# EAGLE design BuckTest (EAGLE 5.11)
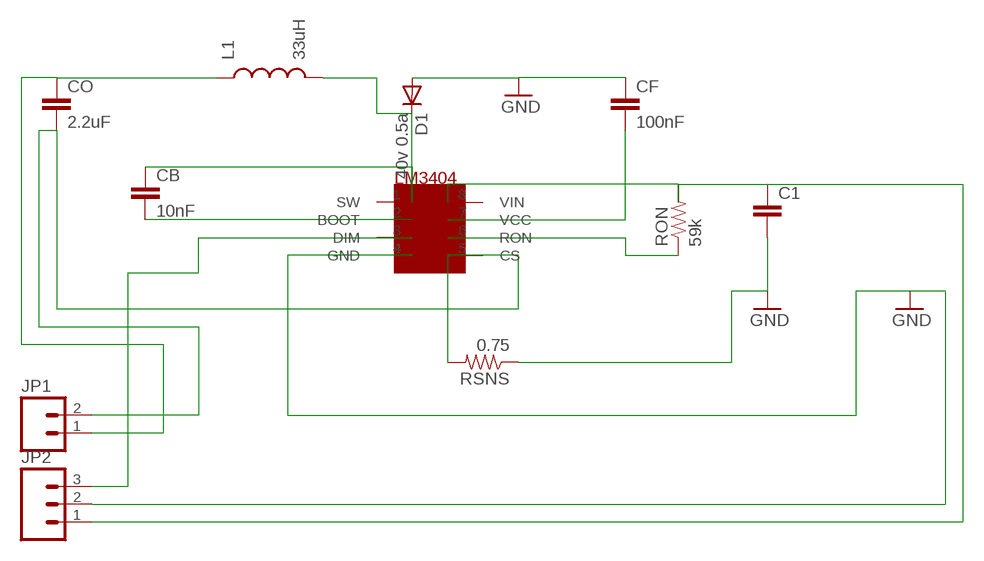
[diagram p0: schematic, sheet 1]

## Parts
C1  CAP1206  [1206]
CB  10nF  CAP0805  [0805]
CF  100nF  CAP0805  [0805]
CO  2.2uF  CAP0805  [0805]
D1  40v 0.5a  CGRM4001-G  [SOD-123_MINI-SMA]
JP1  M02LOCK  [1X02_LOCK]
JP2  M03PTH  [1X03]
L1  33uH  INDUCTORCR75  [CR75]
RON  59k  RESISTOR0603-RES  [0603-RES]
RSNS  0.75  RESISTOR0805-RES  [0805]
U$1  LM3404LM3404-SOIC8  [SOIC8]

## Nets
GND: C1.2 CF.1 D1.A JP2.2 RSNS.1 U$1.4(GND)
N$1: CB.2 U$1.2(BOOT)
N$2: RON.1 U$1.6(RON)
N$3: CB.1 D1.C L1.P$2 U$1.1(SW)
N$4: CO.1 JP1.1 L1.P$1
N$5: CO.2 JP1.2 RSNS.2 U$1.5(CS)
N$7: CF.2 U$1.7(VCC)
N$8: JP2.3 U$1.3(DIM)
VIN: C1.1 JP2.1 RON.2 U$1.8(VIN)

## Library data of the parts
C1 CB CF CO = SparkFun:CAP: Capacitor Standard 0603 ceramic capacitor, and 0.1" leaded capacitor.
D1 = diode:CGRM400*-G: Molded plasitc,JEDEC SOD-123/Mini SMA Source: Comchip CGRM4001-G.pdf
JP1 = SparkFun:M02: Header 2 Standard 2-pin 0.1" header. Use with straight break away headers (SKU : PRT-00116), right angle break away headers (PRT-00553), swiss pins (PRT-00743), machine pins (PRT-00117), and female headers (PRT-00115). Molex polarized connector foot print use with SKU : PRT-08233 with associated crimp pins and housings.
JP2 = SparkFun:M03: Header 3 Standard 3-pin 0.1" header. Use with straight break away headers (SKU : PRT-00116), right angle break away headers (PRT-00553), swiss pins (PRT-00743), machine pins (PRT-00117), and female headers (PRT-00115). Molex polarized connector foot print use with SKU : PRT-08232 with associated crimp pins and housings.
L1 = SparkFun:INDUCTOR: Inductors Basic Inductor/Choke - 0603 and 1206. Footprints are not proven and vary greatly between part numbers.
RON RSNS = SparkFun:RESISTOR: Resistor Basic schematic elements and footprints for 0603, 1206, and PTH resistors.
U$1 = SparkFun:LM3404

## Net classes
0 default: width 0.508 mm, drill 1.016 mm, clearance 0.508 mm

## Board
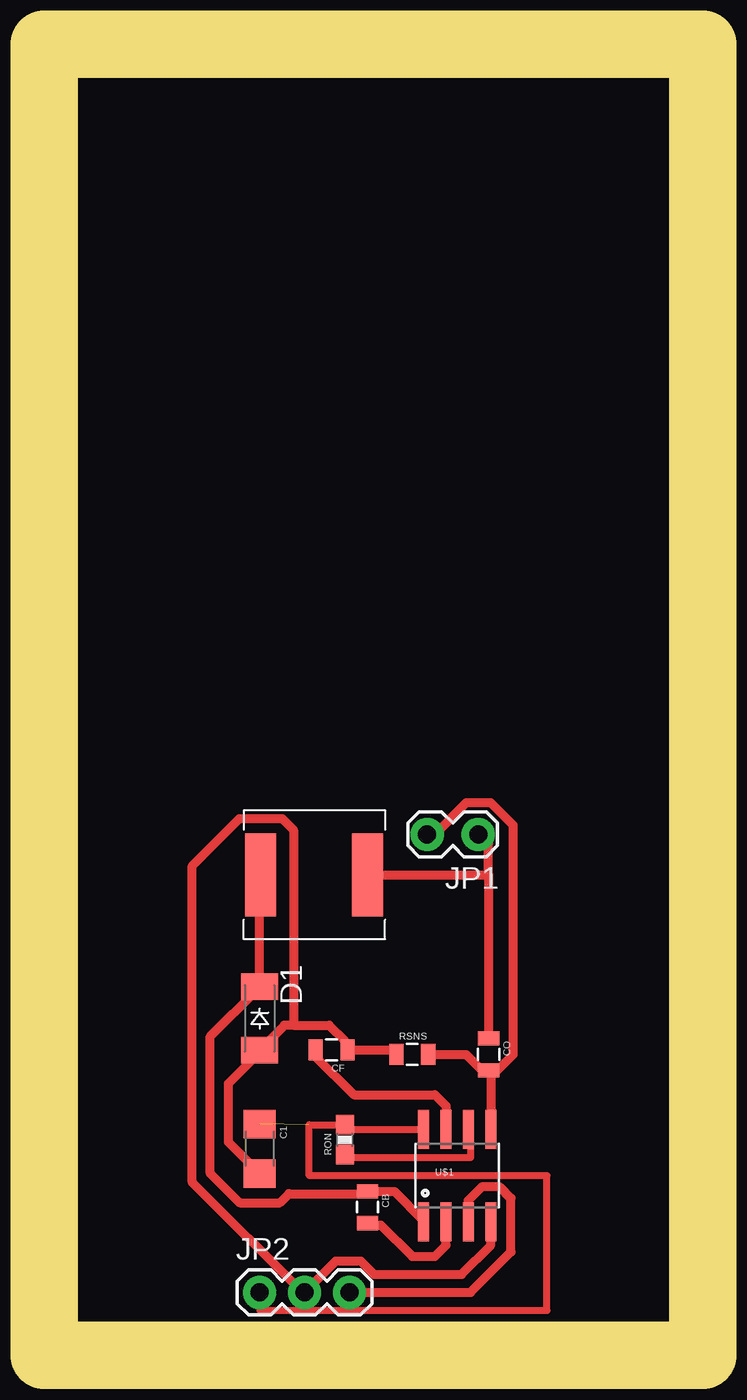
[diagram p1: board, top side]

Size 37.26 x 74.16 mm. Coordinates in mm from the lower left corner, seen from the top.
Outline: 0,0 37.26,0 37.26,74.16 0,74.16 0,0
Copper layers (1*16): Top 0.035mm / dielectric 1.5mm / Bottom 0.035mm
Design rules "default *": minimum track width 10mil, minimum drill 24mil, track to track 20mil, track to pad 20mil, pad to pad 20mil, via to via 20mil, smd to smd 20mil, copper to edge 40mil, drill to drill 8mil, minimum pad ring 10mil, minimum via ring 8mil, stop-mask expansion 4mil, vias tented up to drill 0mil, thermal gap 10mil

### Footprints (pad centres in the part's own frame; a part is rotated, then mirrored left to right if it is on the bottom)
1206 = smd 1.6 x 1.8: 1 -1.4,0; 2 1.4,0
0805 = smd 0.8 x 1.2: 1 -0.9,0; 2 0.9,0
SOD-123_MINI-SMA = smd 1.5 x 2.1: A 1.8,0; C -1.8,0
1X02_LOCK = drill 1.016 pad 1.88 round: 1 -0.178,0; 2 2.718,0
1X03 = drill 1.016 pad 1.88 round: 1 0,0; 2 2.54,0; 3 5.08,0
CR75 = smd 1.75 x 4.7: P$1 0,0; P$2 6.05,0
0603-RES = smd 1.1 x 1: 1 -0.85,0; 2 0.85,0
SOIC8 = smd 0.61 x 2.21: 1 -1.905,-2.616; 2 -0.635,-2.616; 3 0.635,-2.616; 4 1.905,-2.616; 5 1.905,2.616; 6 0.635,2.616; 7 -0.635,2.616; 8 -1.905,2.616

### Placement (x,y rotation side)
C1  12.19,11.68 270 top
CB  18.29,8.38 270 top
CF  16.26,17.27 180 top
CO  25.15,17.02 270 top
D1  12.19,19.05 270 top
JP1  24.38,29.46 180 top
JP2  12.19,3.56 0 top
L1  18.29,27.18 180 top
RON  17.02,12.19 90 top
RSNS  20.83,17.02 0 top
U$1  23.37,10.16 0 top

### Tracks (layer width: path | path; a pad name or v marks a point on that pad's centre or on a via)
GND
  Top 0.508: RSNS.1 19.81,17.02 19.56,17.27 CF.1 17.02,17.4 17.02,17.78 16.13,18.67 14.1,18.67 | C1.2 10.41,12.06 10.41,15.37 12.19,17.14 D1.A 12.32,17.4 13.59,18.67 14.1,18.67 | U$1.4 25.27,6.22 23.62,4.57 18.67,4.57 17.91,5.33 16.51,5.33 JP2.2 14.61,3.56 8.38,9.78 8.38,27.69 11.05,30.35 13.46,30.35 14.1,29.72 14.1,18.67
N$1
  Top 0.508: CB.2 18.29,7.37 19.05,7.37 20.83,5.59 22.1,5.59 22.73,6.22 U$1.2
N$2
  Top 0.406: U$1.6 24.13,12.78 24.13,11.18 17.02,11.18 RON.1
N$3
  Top 0.508: U$1.1 21.46,7.62 19.81,9.27 CB.1 18.16,9.14 13.84,9.14 13.34,8.64 11.05,8.64 9.4,10.29 9.4,18.03 12.07,20.7 D1.C 12.19,27.18 L1.P$2
N$4
  Top 0.508: 25.15,27.18 25.15,28.96 24.64,29.46 JP1.1 | 25.15,27.18 CO.1 | L1.P$1 25.15,27.18
N$5
  Top 0.508: RSNS.2 23.88,17.02 24.77,16.13 CO.2 | U$1.5 25.27,16 CO.2 | JP1.2 22.1,29.46 23.88,31.24 25.27,31.24 26.54,29.97 26.54,17.02 25.53,16 CO.2
N$7
  Top 0.508: CF.2 15.37,16.89 17.53,14.73 22.1,14.73 22.73,14.1 U$1.7
N$8
  Top 0.508: JP2.3 24.13,3.56 26.42,5.84 26.42,8.89 25.78,9.53 24.77,9.53 24,8.76 U$1.3
VIN  (1 unrouted)
  Top 0.406: U$1.8 17.02,12.78 RON.2 14.99,13.04 14.99,10.16 28.45,10.16 28.45,2.54 12.19,2.54 JP2.1
  Top 0.508: C1.1